# Altium project plp-cm_2a.PrjPcb
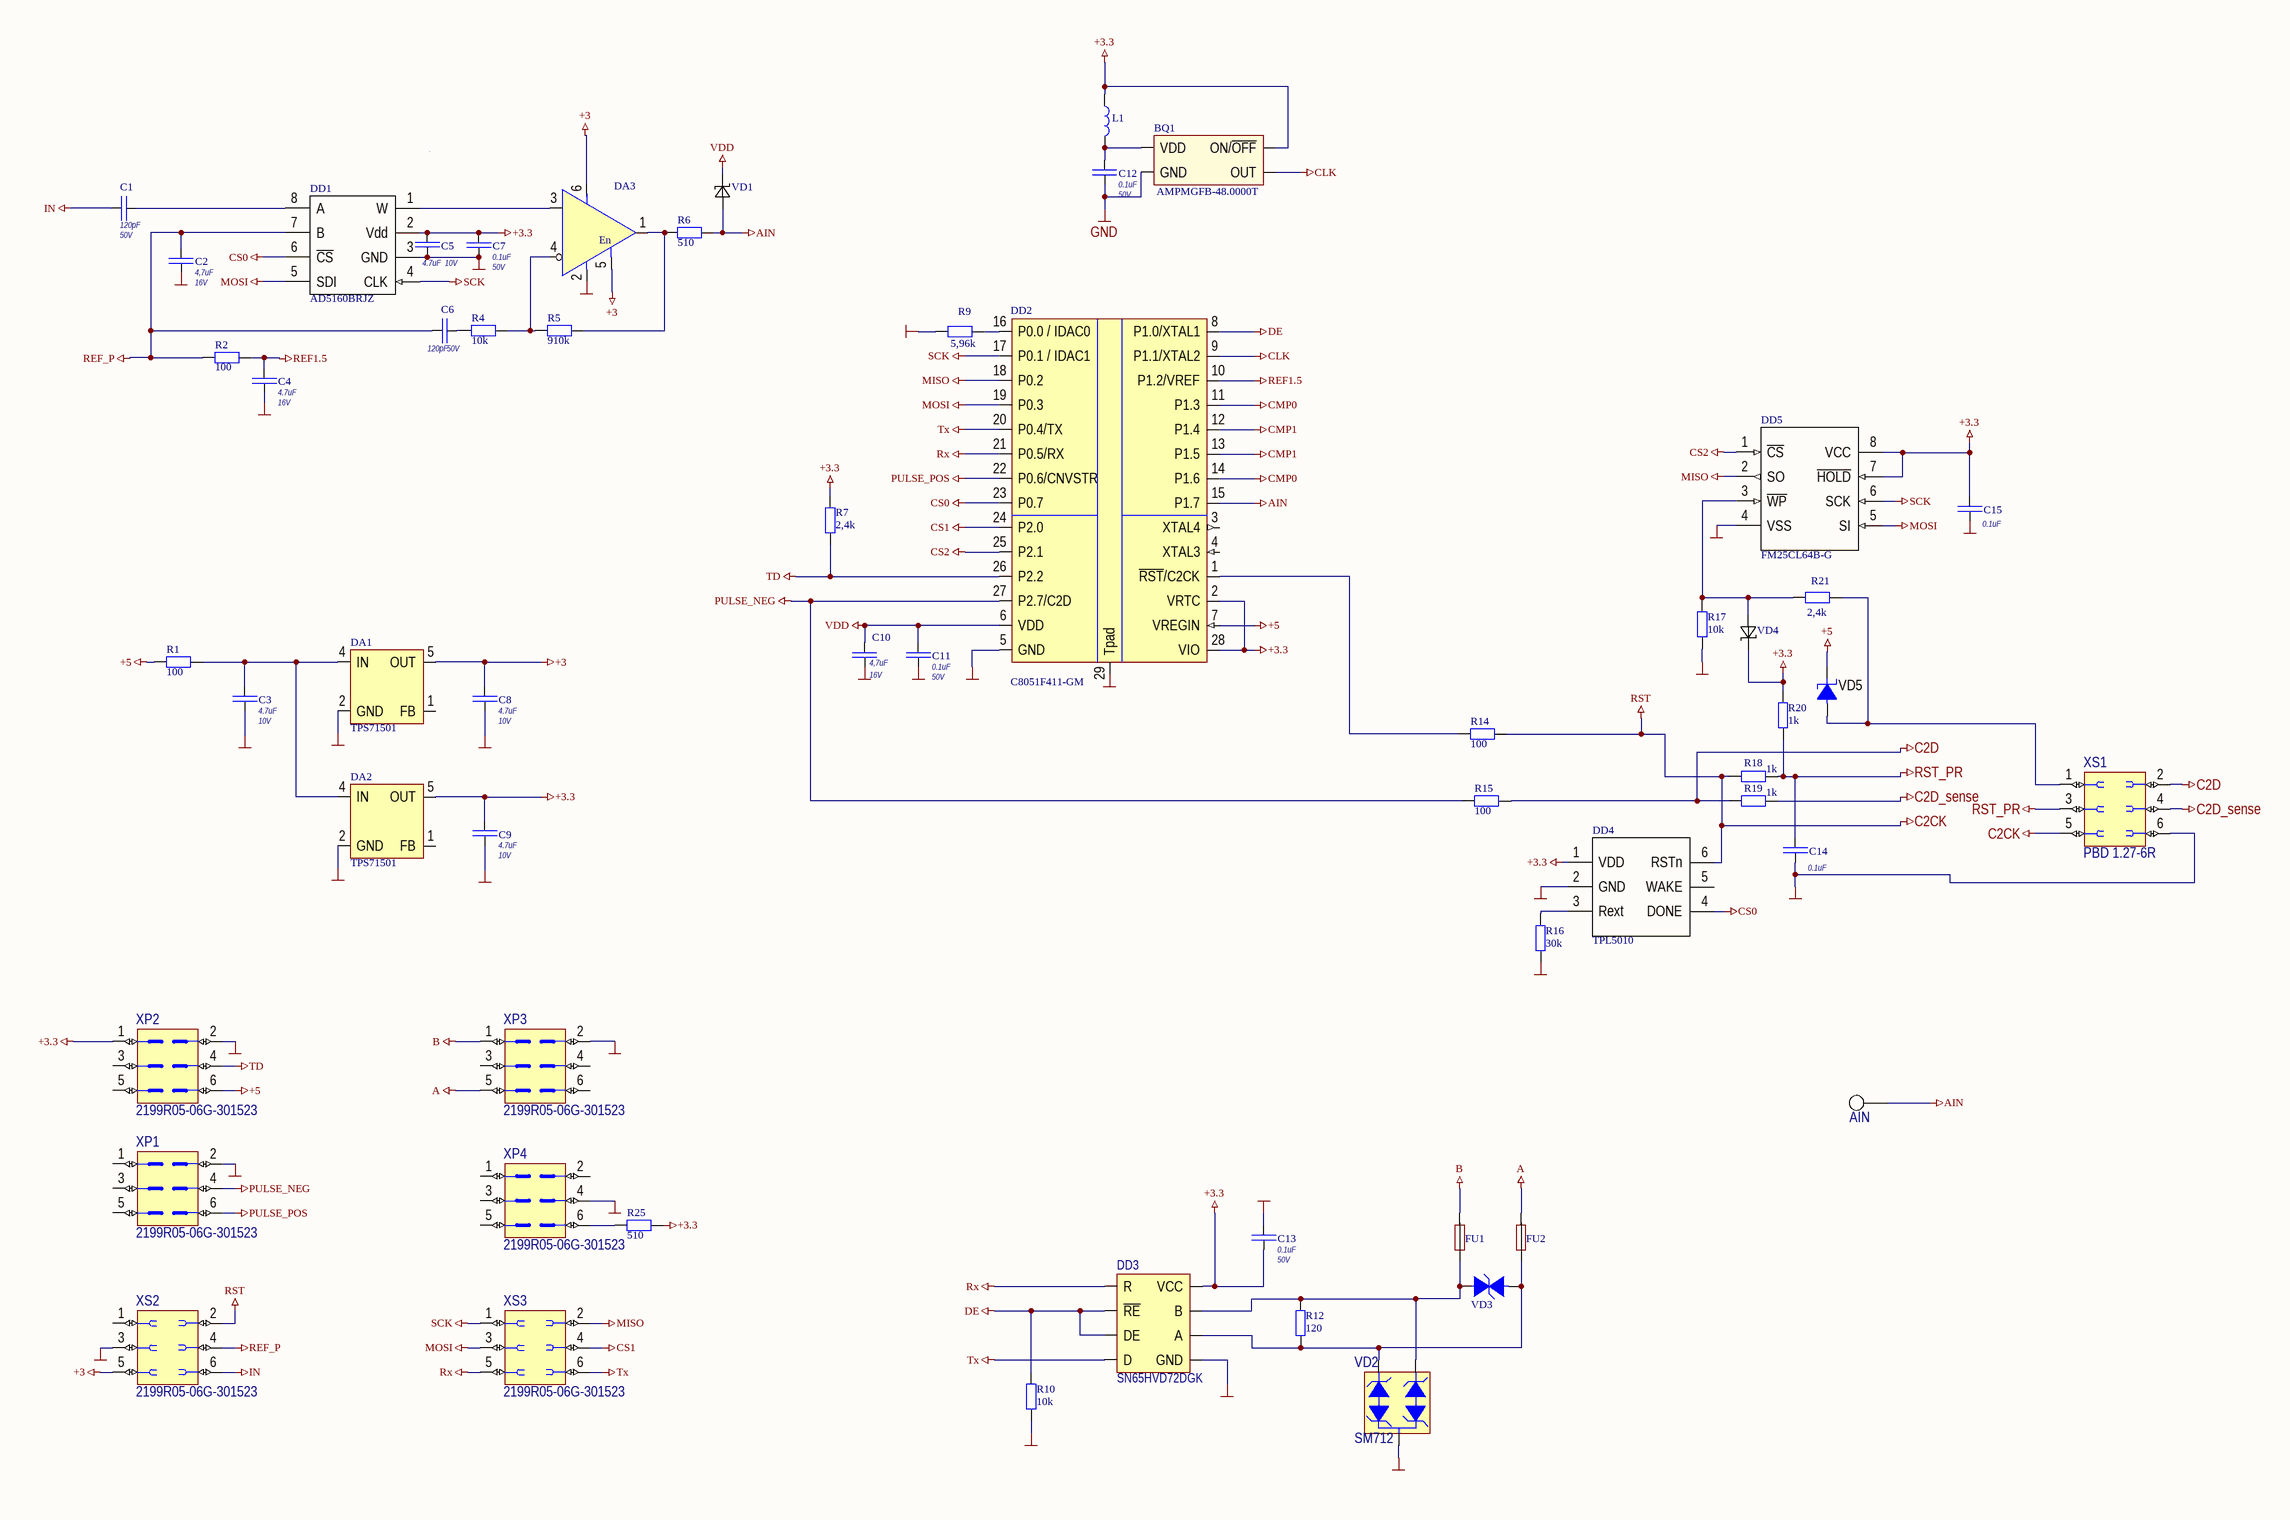
[diagram p0: plp-cm_2a.SchDoc]
1 sheet, 58 parts. Net scope: global (net labels, ports and power ports of the same name join across sheets).
Board file: plp-cm_2a.PcbDoc

## Sheet plp-cm_2a.SchDoc: Плата ПЛП-CM
size 594 x 420 mm; ApprovedBy: Судаков; CheckedBy: Сарайкин; DocumentNumber: ВГАР.469135.008 Э3; SheetNumber: 1; SheetTotal: 1; PageSetup: Record=PageOptions|CenterHorizontal=False|CenterVertical=False|PrintScale=0.92|XCorrection=0.00|YCorrection=0.00|PrintKind=2|BorderSize=5000000|LeftOffset=0|BottomOffset=0|Orientation=2|PaperLength=4200|PaperWidth=2970|Scale=100|PaperSource=7|PrintQuality=600|MediaType=1|DitherType=10|PaperKind=A3|PrintScaleMode=1; Title2str: Схема электрическая принципиальная; ProcessInspection: Казанов; NormInspection: Коваленко; FirstReferrence: ВГАР.469135.008 Э3; Rule: PcbType=ProtelPcb; Rule: PcbType=ProtelPcb; Rule: PcbType=ProtelPcb; Rule: PcbType=ProtelPcb; Rule: PcbType=ProtelPcb; Rule: PcbType=ProtelPcb; Rule: PcbType=ProtelPcb; Rule: PcbType=ProtelPcb; Rule: PcbType=ProtelPcb; Rule: PcbType=ProtelPcb; Rule: PcbType=ProtelPcb; Rule: PcbType=ProtelPcb

### Parts
AIN  Testpoint_HS1mm  [TestPoint(1mm_HS)]  (value not drawn)
BQ1  AMPMGFB-48.0000T  [AMPMGFB(1.6x1.2)]
C1  value 120pF  Rated DC Voltage: 50V  [CAPC_0603(1608)X080L]  (hidden comment: Capacitor Ceramic)
C2  value 4,7uF  Rated DC Voltage: 16V  [CAPC_0603(1608)X080L]  (hidden comment: Capacitor Ceramic)
C3  value 4.7uF  Rated DC Voltage: 10V  [CAPC_0603(1608)X080L]  (hidden comment: Capacitor Ceramic)
C4  value 4.7uF  Rated DC Voltage: 16V  [CAPC_0603(1608)X080L]  (hidden comment: Capacitor Ceramic)
C5  value 4.7uF  Rated DC Voltage: 10V  [CAPC_0603(1608)X080L]  (hidden comment: Capacitor Ceramic)
C6  value 120pF  Rated DC Voltage: 50V  [CAPC_0603(1608)X080L]  (hidden comment: Capacitor Ceramic)
C7  value 0.1uF  Rated DC Voltage: 50V  [CAPC_0603(1608)X080L]  (hidden comment: Capacitor Ceramic)
C8  value 4.7uF  Rated DC Voltage: 10V  [CAPC_0603(1608)X080L]  (hidden comment: Capacitor Ceramic)
C9  value 4.7uF  Rated DC Voltage: 10V  [CAPC_0603(1608)X080L]  (hidden comment: Capacitor Ceramic)
C10  value 4,7uF  Rated DC Voltage: 16V  [CAPC_0603(1608)X080L]  (hidden comment: Capacitor Ceramic)
C11  value 0.1uF  Rated DC Voltage: 50V  [CAPC_0603(1608)X080L]  (hidden comment: Capacitor Ceramic)
C12  value 0.1uF  Rated DC Voltage: 50V  [CAPC_0603(1608)X080L]  (hidden comment: Capacitor Ceramic)
C13  value 0.1uF  Rated DC Voltage: 50V  [CAPC_0603(1608)X080L]  (hidden comment: Capacitor Ceramic)
C14  value 0.1uF  [CAPC_0603(1608)X080L]  (hidden comment: Capacitor Ceramic)
C15  value 0.1uF  [CAPC_0603(1608)X080L]  (hidden comment: Capacitor Ceramic)
DA1  TPS71501  [SC-70-5]
DA2  TPS71501  [SC-70-5]
DA3  OPA363AIDBV  [SOT23-6]  (value not drawn)
DD1  AD5160BRJZ  [SOT23-8]
DD2  C8051F411-GM  [QFN-28]
DD3  SN65HVD72DGK  [VSSOP-8]
DD4  TPL5010  [SOT23-6]
DD5  FM25CL64B-G  [SO-8_N]
FU1  0zcm0002ff2g  [FUSE: 0603]  (value not drawn)
FU2  0zcm0002ff2g  [FUSE: 0603]  (value not drawn)
L1  BLM18AG102SN1D  [IND: 0603]  (value not drawn)
R1  value 100  [RESC1608(0603)X04L]  (hidden comment: R0603L)
R2  value 100  [RESC1608(0603)X04L]  (hidden comment: R0603L)
R4  value 10k  [RESC1608(0603)X04L]  (hidden comment: R0603L)
R5  value 910k  [RESC1608(0603)X04L]  (hidden comment: R0603L)
R6  value 510  [RESC1608(0603)X04L]  (hidden comment: R0603L)
R7  value 2,4k  [RESC1608(0603)X04L]  (hidden comment: R0603L)
R9  value 5,96k  [RESC1608(0603)X04L]  (hidden comment: R0603L)
R10  value 10k  [RESC1608(0603)X04L]  (hidden comment: R0603L)
R12  value 120  [RESC1608(0603)X04L]  (hidden comment: R0603L)
R14  value 100  [RESC1608(0603)X04L]  (hidden comment: R0603L)
R15  value 100  [RESC1608(0603)X04L]  (hidden comment: R0603L)
R16  value 30k  [RESC1608(0603)X04L]  (hidden comment: R0603L)
R17  value 10k  [RESC1608(0603)X04L]  (hidden comment: R0603L)
R18  value 1k  [RESC1608(0603)X04L]  (hidden comment: R0603L)
R19  value 1k  [RESC1608(0603)X04L]  (hidden comment: R0603L)
R20  value 1k  [RESC1608(0603)X04L]  (hidden comment: R0603L)
R21  value 2,4k  [RESC1608(0603)X04L]  (hidden comment: R0603L)
R25  value 510  [RESC1608(0603)X04L]  (hidden comment: R0603L)
VD1  BAT54XV2  [SOD523 - ONs]  (value not drawn)
VD2  SM712  [SOT23]
VD3  SMBJ10CA-TR  [DIODE: SMB]  (value not drawn)
VD4  BAT54XV2  [SOD523 - ONs]  (value not drawn)
VD5  (no value)  [DIODE: SOD523]
XP1  2199R05-06G-301523  [CON: PLL-6(2x3R1.27male)]
XP2  2199R05-06G-301523  [CON: PLL-6(2x3R1.27male)]
XP3  2199R05-06G-301523  [CON: PLL-6(2x3R1.27male)]
XP4  2199R05-06G-301523  [CON: PLL-6(2x3R1.27male)]
XS1  PBD 1.27-6R  [CON: PLLD-6R(1.27)]
XS2  2199R05-06G-301523  [CON: PLL-6(2x3R1.27female)]
XS3  2199R05-06G-301523  [CON: PLL-6(2x3R1.27female)]

### Nets
+3: C8.2 DA1.5(OUT) DA3.5(EN) DA3.6(+V) XS2.5
+3.3: BQ1.1(ON/~{OFF}) C5.2 C7.1 C9.2 C13.2 C15.1 DA2.5(OUT) DD1.2(Vdd) DD2.2(VRTC) DD2.28(VIO) DD3.8(VCC) DD4.1(VDD) DD5.7(~{HOLD}) DD5.8(VCC) L1.1 R7.1 R20.2 R25.1 VD4.2(catode) XP2.1
+5: DD2.7(VREGIN) R1.1 VD5.2 XP2.6
A: FU2.2 XP3.5
AIN: AIN.1 DD2.15(P1.7) R6.2 VD1.1(anode)
B: FU1.2 XP3.1
C2CK: DD4.6(RSTn) R14.1 R18.1 XS1.5 XS2.2  [also labelled RST]
C2D: R15.1 R19.1 XS1.2
C2D_sense: R19.2 XS1.4
CLK: BQ1.3(OUT) DD2.9(P1.1/XTAL2)
CMP0: DD2.11(P1.3) DD2.14(P1.6)
CMP1: DD2.12(P1.4) DD2.13(P1.5)
CS0: DD1.6(~{CS}) DD2.23(P0.7) DD4.4(DONE)
CS1: DD2.24(P2.0) XS3.4
CS2: DD2.25(P2.1) DD5.1(~{CS})
DE: DD2.8(P1.0/XTAL1) DD3.2(~{RE}) DD3.3(DE) R10.2
GND: BQ1.2(GND) C2.2 C3.1 C4.2 C5.1 C7.2 C8.1 C9.1 C10.2 C11.2 C12.2 C13.1 C14.2 C15.2 DA1.2(GND) DA2.2(GND) DA3.2(-V) DD1.3(GND) DD2.5(GND) DD2.29(Tpad) DD3.5(GND) DD4.2(GND) DD5.4(VSS) R9.1 R10.1 R16.1 R17.2 VD2.3 XP1.2 XP2.2 XP3.2 XP4.4 XS1.6 XS2.3
IN: C1.2 XS2.6
MISO: DD2.18(P0.2) DD5.2(SO) XS3.2
MOSI: DD1.5(SDI) DD2.19(P0.3) DD5.5(SI) XS3.3
PULSE_NEG: DD2.27(P2.7/C2D) R15.2 XP1.4
PULSE_POS: DD2.22(P0.6/CNVSTR) XP1.6
REF1.5: C4.1 DD2.10(P1.2/VREF) R2.2
REF_P: C2.1 C6.2 DD1.7(B) R2.1 XS2.4
RST_PR: C14.1 R18.2 R20.1 XS1.3
Rx: DD2.21(P0.5/RX) DD3.1(R) XS3.5
SCK: DD1.4(CLK) DD2.17(P0.1_/_IDAC1) DD5.6(SCK) XS3.1
TD: DD2.26(P2.2) R7.2 XP2.4
Tx: DD2.20(P0.4/TX) DD3.4(D) XS3.6
VDD: C10.1 C11.1 DD2.6(VDD) VD1.2(catode)
NetBQ1_4: BQ1.4(VDD) C12.1 L1.2
NetC1_1: C1.1 DD1.8(A)
NetC3_2: C3.2 DA1.4(IN) DA2.4(IN) R1.2
NetC6_1: C6.1 R4.1
NetDA3_1: DA3.1(Vout) R5.2 R6.1
NetDA3_3: DA3.3(+In) DD1.1(W)
NetDA3_4: DA3.4(-In) R4.2 R5.1
NetDD2_1: DD2.1(~{RST}/C2CK) R14.2
NetDD2_16: DD2.16(P0.0_/_IDAC0) R9.2
NetDD3_6: DD3.6(A) FU2.1 R12.1 VD2.2 VD3.1
NetDD3_7: DD3.7(B) FU1.1 R12.2 VD2.1 VD3.2
NetDD4_3: DD4.3(Rext) R16.2
NetDD5_3: DD5.3(~{WP}) R17.1 R21.2 VD4.1(anode)
NetR21_1: R21.1 VD5.1 XS1.1
NetR25_2: R25.2 XP4.6

Not connected (* = marked no-connect by the designer): DA1 1(FB); DA2 1(FB); DD2 3(XTAL4) 4(XTAL3); DD4 5(WAKE); XP1 1 3 5; XP2 3 5; XP3 3 4 6; XP4 1 2 3 5; XS2 1

### Notes on the sheet
- Перв. примен.
- Справ. №
- Подп. и дата
- Инв. № дубл.
- Взам. инв. №
- Разраб.
- Изм.
- Лист
- № докум.
- Подп.
- Дата
- Лит.
- Масса
- Масштаб
- Пров.
- Т.контр.
- Листов
- Инв. № подл.
- Утв.
- Н.контр.
- 2.106-A2
- Копировал
- Формат А2
- (in symbol OPA363AIDBV) En

### Library data of the parts
C1 C6 = Capacitor Ceramic: Конденсатор; Manufacturer: Murata; ReplacementPart1Manufacturer: TDK; ReplacementPart2Manufacturer: Taiyo Yuden; ESR: * mOhm; OrderCode: 0603 - 120пФ ±5% 50В - NPO; TC Code: X7R; Tolerance: ±5%; Case: 0603; ComponentLink1Description: Global Data; ComponentLink1URL: http://www.murata.com/products/capacitor/tech_data/index.html; ComponentLink2Description: Part Data Sheet; ComponentLink2URL: *; ComponentLink3Description: Replacement Data Sheet; ComponentLink3URL: *; ComponentLink4Description: Replacement 2 Data Sheet; ComponentLink4URL: *; PartNumber: *; ReplacementPart1PartNumber: *; ReplacementPart2PartNumber: *; Ripple Current Rating: *; Temperature Range: -55 to +125°C
C2 = Capacitor Ceramic: Конденсатор; Manufacturer: Murata; ReplacementPart1Manufacturer: TDK; ReplacementPart2Manufacturer: Taiyo Yuden; ESR: * mOhm; OrderCode: 0603 - 10мкФ ±10% - 6.3В - X5R; TC Code: X5R; Tolerance: ±10%; Case: 0603; ComponentLink1Description: Global Data; ComponentLink1URL: http://www.murata.com/products/capacitor/tech_data/index.html; ComponentLink2Description: Part Data Sheet; ComponentLink2URL: *; ComponentLink3Description: Replacement Data Sheet; ComponentLink3URL: *; ComponentLink4Description: Replacement 2 Data Sheet; ComponentLink4URL: *; PartNumber: *; ReplacementPart1PartNumber: *; ReplacementPart2PartNumber: *; Ripple Current Rating: *; Temperature Range: -55 to +125°C
C3 C5 C8 C9 = Capacitor Ceramic: Конденсатор; Manufacturer: Murata; ReplacementPart1Manufacturer: TDK; ReplacementPart2Manufacturer: Taiyo Yuden; ESR: * mOhm; OrderCode: 0603 - 4,7мкФ ±10% - 10В - X5R; TC Code: X5R; Tolerance: ±10%; Case: 0603; ComponentLink1Description: Global Data; ComponentLink1URL: http://www.murata.com/products/capacitor/tech_data/index.html; ComponentLink2Description: Part Data Sheet; ComponentLink2URL: *; ComponentLink3Description: Replacement Data Sheet; ComponentLink3URL: *; ComponentLink4Description: Replacement 2 Data Sheet; ComponentLink4URL: *; PartNumber: *; ReplacementPart1PartNumber: *; ReplacementPart2PartNumber: *; Ripple Current Rating: *; Temperature Range: -55 to +125°C
C4 C7 C11-C13 = Capacitor Ceramic: Конденсатор; Manufacturer: Murata; ReplacementPart1Manufacturer: TDK; ReplacementPart2Manufacturer: Taiyo Yuden; ESR: * mOhm; OrderCode: 0603 - 0,1мкФ ±10% - 50В - X7R; TC Code: X7R; Tolerance: ±10%; Case: 0603; ComponentLink1Description: Global Data; ComponentLink1URL: http://www.murata.com/products/capacitor/tech_data/index.html; ComponentLink2Description: Part Data Sheet; ComponentLink2URL: *; ComponentLink3Description: Replacement Data Sheet; ComponentLink3URL: *; ComponentLink4Description: Replacement 2 Data Sheet; ComponentLink4URL: *; PartNumber: *; ReplacementPart1PartNumber: *; ReplacementPart2PartNumber: *; Ripple Current Rating: *; Temperature Range: -55 to +125°C
C10 = Capacitor Ceramic: Конденсатор; Manufacturer: Murata; ReplacementPart1Manufacturer: TDK; ReplacementPart2Manufacturer: Taiyo Yuden; ESR: * mOhm; OrderCode: 0603 - 56пФ ±10% - 50В - NPO; TC Code: NPO; Tolerance: ±5%; Case: 0603; ComponentLink1Description: Global Data; ComponentLink1URL: http://www.murata.com/products/capacitor/tech_data/index.html; ComponentLink2Description: Part Data Sheet; ComponentLink2URL: *; ComponentLink3Description: Replacement Data Sheet; ComponentLink3URL: *; ComponentLink4Description: Replacement 2 Data Sheet; ComponentLink4URL: *; PartNumber: *; ReplacementPart1PartNumber: *; ReplacementPart2PartNumber: *; Ripple Current Rating: *; Temperature Range: -55 to +125°C
C14 C15 = Capacitor Ceramic: Конденсатор; Manufacturer: Murata; ReplacementPart1Manufacturer: TDK; ReplacementPart2Manufacturer: Taiyo Yuden; ESR: * mOhm; OrderCode: 0603 - 0,1мкФ ±10% - 50В - X7R; TC Code: X7R; Tolerance: ±10%; Rated DC Voltage: 50V; Case: 0603; ComponentLink1Description: Global Data; ComponentLink1URL: http://www.murata.com/products/capacitor/tech_data/index.html; ComponentLink2Description: Part Data Sheet; ComponentLink2URL: *; ComponentLink3Description: Replacement Data Sheet; ComponentLink3URL: *; ComponentLink4Description: Replacement 2 Data Sheet; ComponentLink4URL: *; PartNumber: *; ReplacementPart1PartNumber: *; ReplacementPart2PartNumber: *; Ripple Current Rating: *; Temperature Range: -55 to +125°C
DA1 DA2 = TPS71501: Микросхема; Manufacturer: Texas Instruments; ComponentLink1Description: Data Sheet
DA3 = OPA363AIDBV: 1.8V, 7MHz, 90dB CMRR,  Single-Supply, Rail-to-Rail I/O Operational Amplifier
DD1 = AD5160: Микросхема; Manufacturer: Analog Devices; PartNumber: AD5160BRJZ
DD2 = C8051F411-GM: 50MIPS 32kB Flash 2k RAM 8-Bit Microcontroller; Manufacturer: Silabs; ComponentLink1Description: Data Sheet; ComponentLink2Description: Replacement 1 Data Sheet; ComponentLink3Description: Replacement 2 Data Sheet; PartNumber: C8051F411-GM
DD3 = SN65HVD72DGK: RS-485/422; ComponentLink1Description: Datasheet; ComponentLink1URL: https://www.ti.com/lit/ds/symlink/sn65hvd72.pdf?ts=1607084930164&ref_url=https%253A%252F%252Fwww.ti.com%252Fstore%252Fti%252Fen%252Fp%252Fproduct%252F%253Fp%253DSN65HVD72DRBT
DD4 = TLP5010
DD5 = FM25CL64B-G: Микросхема; ReplacementPart1Manufacturer: ISSI; ReplacementPart1PartNumber: IS25C08-2ZLI-TR; ComponentLink1Description: Manufacturer Link; ComponentLink1URL: http://www.microchip.com; ComponentLink2Description: Datasheet; ComponentLink3Description: Packaging Specification; PartNumber: FM25CL64B-G; Manufacturer: FM25CL64B-G
FU1 FU2 = FUSE:0603
L1 = BLM18AG102SN1D: 100MHz 1K
R1 R2 R4-R7 R9 R10 R12 R14-R21 R25 = R0603L: Резистор; Manufacturer: Bourns; Max Rated DC Voltage: 100 В; Power: 1/10 Вт; Rated DC Voltage: 50 В; Rated T: -55 °C to +125 °C; Resistance Code: 0603 {Value} Ом ±1 %; TKR: ±100 ppm; Tolerance: ±1 %; ComponentLink1Description: Data Sheet; ComponentLink1URL: http://smd.ru/files/upload/1207/ru/chip-resis.pdf; Case: 0603; ComponentLink2Description: Specific Res Only; ComponentLink2URL: *; ComponentLink3Description: Replacement Data Sheet; ComponentLink3URL: *; ComponentLink4Description: Replacement 2 Data Sheet; ComponentLink4URL: *; OrderCode: *; PartNumber: *; ReplacementPart1Manufacturer: *; ReplacementPart1PartNumber: *; ReplacementPart2Manufacturer: *; ReplacementPart2PartNumber: *; Temperature Range: -55 to +125°C
VD1 VD4 = BAT54XV2: shottky diode; Manufacturer: ON Semiconductor; ComponentLink1Description: Data Sheet; ComponentLink2Description: Replacement 1 Data Sheet; ComponentLink3Description: Replacement 2 Data Sheet
VD2 = SM712: EIA RS-485 ±7V
VD5 = Schottky_single: Manufacturer: Diodes Incorporated; ValueManufacturerPartNumber: Schottky diode, 80V, 500mA, 1V, 15pF, SOD-123, -55...+150°C; PartNumber: MBR0580S1-7; TypeDiode: Schottky diode; Voltage: 80V; Current: 500mA; VoltageDrop: 1V; RecoveryTime: 15pF; Package: SOD-123; HelpURL: https://www.digikey.com/product-detail/en/diodes-incorporated/MBR0580S1-7/MBR0580S1-7DICT-ND/5080371; Temperature: -55...+150°C
XP1-XP4 = 2199R05-06G-301523Out: Step 1.27 R
XS2 XS3 = 2199R05-06G-301523In: Step 1.27